# EAGLE design expresscard_micro (EAGLE 7.7.0)
A micro-controller designed to fit into an express card slot and become an integrated part of the computer
COMPANY: ADAFRUIT INDUSTRIES; DRAWN: KTOWN; REV: B
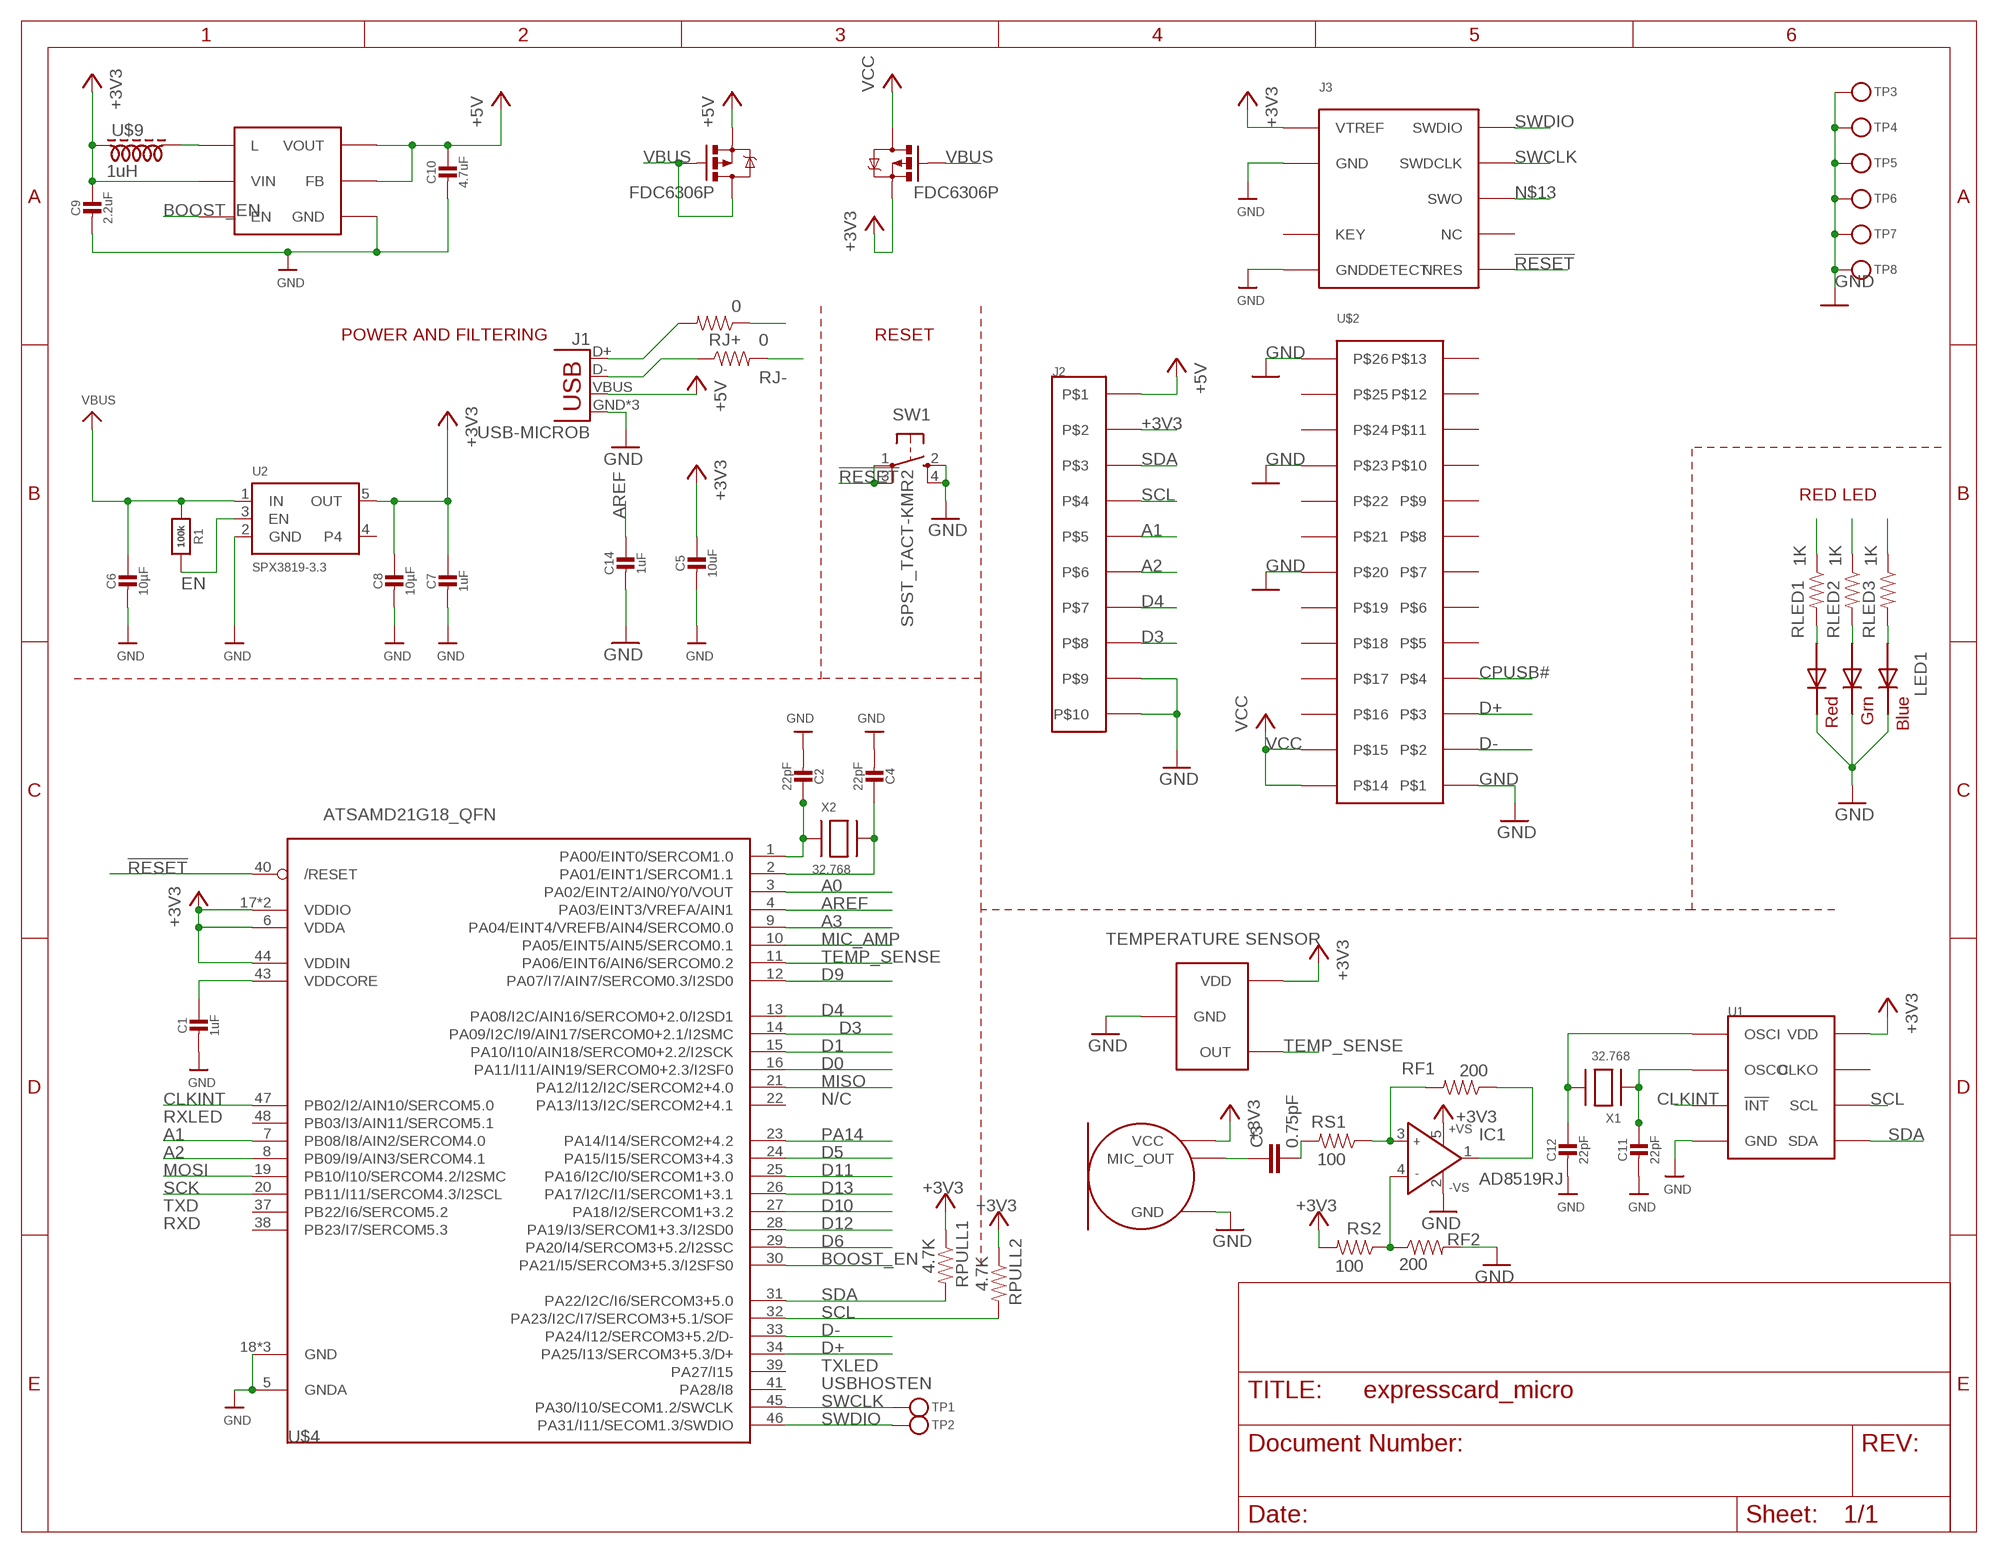
[diagram p0: schematic, sheet 1]

## Parts
C1  1uF  CAP_CERAMIC0603_NO  [0603-NO]
C2  22pF  CAP_CERAMIC0603_NO  [0603-NO]
C3  0.75pF  0.75PF-50V(-/+.25PF)(0603)  [0603-CAP]
C4  22pF  CAP_CERAMIC0603_NO  [0603-NO]
C5  10uF  CAP_CERAMIC0805-NOOUTLINE  [0805-NO]
C6  10µF  CAP_CERAMIC0805-NOOUTLINE  [0805-NO]
C7  1uF  CAP_CERAMIC0603_NO  [0603-NO]
C8  10µF  CAP_CERAMIC0805-NOOUTLINE  [0805-NO]
C9  2.2uF  CAP_CERAMIC0805-NOOUTLINE  [0805-NO]
C10  4.7uF  CAP_CERAMIC0805-NOOUTLINE  [0805-NO]
C11  22pF  CAP_CERAMIC0603_NO  [0603-NO]
C12  22pF  CAP_CERAMIC0603_NO  [0603-NO]
C14  1uF  CAP_CERAMIC0603_NO  [0603-NO]
IC1  AD8519RJ  [SOT23-5]
J1  USB-MICROB  [USB-MICROB]
J2  FCS8_10  [FCS8_10PIN]
J3  JLINK_10PIN  [FTSH-105-01-F-DH]
LED1  RGBLED5050  [RGBLED5050]
R1  100k  RESISTOR_0603_NOOUT  [0603-NO]
RF1  200  0.27OHM-1/10W-1%(0603)  [0603-RES]
RF2  200  0.27OHM-1/10W-1%(0603)  [0603-RES]
RJ+  0  0.27OHM-1/10W-1%(0603)  [0603-RES]
RJ-  0  0.27OHM-1/10W-1%(0603)  [0603-RES]
RLED1  1K  0.27OHM-1/10W-1%(0603)  [0603-RES]
RLED2  1K  0.27OHM-1/10W-1%(0603)  [0603-RES]
RLED3  1K  0.27OHM-1/10W-1%(0603)  [0603-RES]
RPULL1  4.7K  0.27OHM-1/10W-1%(0603)  [0603-RES]
RPULL2  4.7K  0.27OHM-1/10W-1%(0603)  [0603-RES]
RS1  100  0.27OHM-1/10W-1%(0603)  [0603-RES]
RS2  100  0.27OHM-1/10W-1%(0603)  [0603-RES]
SW1  SPST_TACT-KMR2  [KMR2]
TEMPSENSE  MCP9700T-E  [SOT23]
TP1  TESTPOINTROUND1.5MM  [TESTPOINT_ROUND_1.5MM]
TP2  TESTPOINTROUND1.5MM  [TESTPOINT_ROUND_1.5MM]
TP3  TESTPOINTROUND1.5MM  [TESTPOINT_ROUND_1.5MM]
TP4  TESTPOINTROUND1.5MM  [TESTPOINT_ROUND_1.5MM]
TP5  TESTPOINTROUND1.5MM  [TESTPOINT_ROUND_1.5MM]
TP6  TESTPOINTROUND1.5MM  [TESTPOINT_ROUND_1.5MM]
TP7  TESTPOINTROUND1.5MM  [TESTPOINT_ROUND_1.5MM]
TP8  TESTPOINTROUND1.5MM  [TESTPOINT_ROUND_1.5MM]
U1  PCF8563_RTC  [SO08]
U2  SPX3819-3.3  VREG_SOT23-5  [SOT23-5]
U$1  SPW2430HR5H-B  [3.1_2.5_SMD]
U$2  EXPRESSCARD  [EXPRESSCARD_PACK]
U$3  FDC6306P  [SOT-23_6]
U$4  ATSAMD21G18_QFN  ATSAMD21J  [TQFP48]
U$7  TPS61240DRVR  [WSON6]
U$9  1uH  SMD_IND  [2520(1008)]
X1  32.768  XTAL-3.2X1.5  [XTAL3215]
X2  32.768  XTAL-3.2X1.5  [XTAL3215]

## Nets
!RESET: J3.10(NRES) SW1.1(P) SW1.3(P1) U$4.40(/RESET)
+3V3: C5.1 C7.1 C8.1 C9.1 IC1.5(+VS) J2.P2 J3.1(VTREF) RPULL1.1 RPULL2.1 RS2.2 TEMPSENSE.1(VDD) U1.8(VDD) U2.5(OUT) U$1.VDD(VCC) U$3.5(S) U$4.6(VDDA) U$4.17(VDDIO) U$4.36(VDDIO) U$4.44(VDDIN) U$7.P6(VIN) U$9.1
+5V: C10.1 U$3.2(S) U$7.P2(VOUT) U$7.P3(FB)
A0: U$4.3(PA02/EINT2/AIN0/Y0/VOUT)
A1: J2.P5 U$4.7(PB08/I8/AIN2/SERCOM4.0)
A2: J2.P6 U$4.8(PB09/I9/AIN3/SERCOM4.1)
A3: U$4.9(PA04/EINT4/VREFB/AIN4/SERCOM0.0)
AREF: C14.1 U$4.4(PA03/EINT3/VREFA/AIN1)
BOOST_EN: U$4.30(PA21/I5/SERCOM3+5.3/I2SFS0) U$7.P4(EN)
CLKINT: U1.3(!INT) U$4.47(PB02/I2/AIN10/SERCOM5.0)
CPUSB#: U$2.P4
D0: RLED1.1 U$4.16(PA11/I11/AIN19/SERCOM0+2.3/I2SF0)
D1: RLED2.1 U$4.15(PA10/I10/AIN18/SERCOM0+2.2/I2SCK)
D3: J2.P8 U$4.14(PA09/I2C/I9/AIN17/SERCOM0+2.1/I2SMC)
D4: J2.P7 U$4.13(PA08/I2C/AIN16/SERCOM0+2.0/I2SD1)
D5: RLED3.1 U$4.24(PA15/I15/SERCOM3+4.3)
D6: U$4.29(PA20/I4/SERCOM3+5.2/I2SSC)
D9: U$4.12(PA07/I7/AIN7/SERCOM0.3/I2SD0)
D10: U$4.27(PA18/I2/SERCOM1+3.2)
D11: U$4.25(PA16/I2C/I0/SERCOM1+3.0)
D12: U$4.28(PA19/I3/SERCOM1+3.3/I2SD0)
D13: U$4.26(PA17/I2C/I1/SERCOM1+3.1)
D+: RJ+.1 U$2.P3 U$4.34(PA25/I13/SERCOM3+5.3/D+)
D-: RJ-.2 U$2.P2 U$4.33(PA24/I12/SERCOM3+5.2/D-)
DJ+: J1.D+ RJ+.2
DJ-: J1.D- RJ-.1
EN: R1.2 U2.3(EN)
GND: C1.2 C2.2 C4.2 C5.2 C6.2 C7.2 C8.2 C9.2 C10.2 C11.2 C12.2 C14.2 IC1.2(-VS) J1.GND J1.MT1(GND) J1.MT2(GND) J2.P9 J2.P10 J3.3(GND) J3.5(GND) J3.9(GNDDETECT) LED1.4(BLUE_C) LED1.5(RED_C) LED1.6(GREEN_C) RF2.2 SW1.2(S) SW1.4(S1) TEMPSENSE.3(GND) TP3.P$1 TP4.P$1 TP5.P$1 TP6.P$1 TP7.P$1 TP8.P$1 U1.4(GND) U2.2(GND) U$1.GND U$1.GND2(GND) U$2.P1 U$2.P20 U$2.P23 U$2.P26 U$4.5(GNDA) U$4.18(GND) U$4.35(GND) U$4.42(GND) U$7.P1(GND)
MIC_AMP: IC1.1(OUT) RF1.1 U$4.10(PA05/EINT5/AIN5/SERCOM0.1)
MISO: U$4.21(PA12/I12/I2C/SERCOM2+4.0)
MOSI: U$4.19(PB10/I10/SERCOM4.2/I2SMC)
N$1: C3.2 RS1.2
N$2: LED1.2(RED_A) RLED1.2
N$3: IC1.3(IN+) RF1.2 RS1.1
N$4: C3.1 U$1.OUTPUT(MIC_OUT)
N$5: C2.1 U$4.1(PA00/EINT0/SERCOM1.0) X2.P$1
N$6: LED1.1(GREEN_A) RLED2.2
N$7: C4.1 U$4.2(PA01/EINT1/SERCOM1.1) X2.P$2
N$8: IC1.4(IN-) RF2.1 RS2.1
N$9: LED1.3(BLUE_A) RLED3.2
N$10: U$7.P5(L) U$9.2
N$13: J3.6(SWO)
N$15: C11.1 U1.2(OSCO) X1.P$1
N$16: C12.1 U1.1(OSCI) X1.P$2
PA14: U$4.23(PA14/I14/SERCOM2+4.2)
SCK: U$4.20(PB11/I11/SERCOM4.3/I2SCL)
SCL: J2.P4 RPULL2.2 U1.6(SCL) U$4.32(PA23/I2C/I7/SERCOM3+5.1/SOF)
SDA: J2.P3 RPULL1.2 U1.5(SDA) U$4.31(PA22/I2C/I6/SERCOM3+5.0)
SWCLK: J3.4(SWDCLK) TP1.P$1 U$4.45(PA30/I10/SECOM1.2/SWCLK)
SWDIO: J3.2(SWDIO) TP2.P$1 U$4.46(PA31/I11/SECOM1.3/SWDIO)
TEMP_SENSE: TEMPSENSE.2(OUT) U$4.11(PA06/EINT6/AIN6/SERCOM0.2)
VBUS: C6.1 J1.VBUS J2.P1 R1.1 U2.1(IN) U$3.1(G) U$3.3(G) U$3.4(D) ; supply symbol labelled +5V
VCC: U$2.P14 U$2.P15 U$3.6(D)
VDDCORE: C1.1 U$4.43(VDDCORE)
Unconnected: J3.7(KEY) J3.8(NC) U1.7(CLKO) U2.4 U$2.P5 U$2.P6 U$2.P7 U$2.P8 U$2.P9 U$2.P10 U$2.P11 U$2.P12 U$2.P13 U$2.P16 U$2.P17 U$2.P18 U$2.P19 U$2.P21 U$2.P22 U$2.P24 U$2.P25 U$4.22(PA13/I13/I2C/SERCOM2+4.1) U$4.37(PB22/I6/SERCOM5.2) U$4.38(PB23/I7/SERCOM5.3) U$4.39(PA27/I15) U$4.41(PA28/I8) U$4.48(PB03/I3/AIN11/SERCOM5.1)

## Notes on the sheet
- POWER AND FILTERING | RESET
- RED LED
- TEMPERATURE SENSOR
- N/C
- RXLED
- TXD
- RXD
- TXLED
- USBHOSTEN

## Library data of the parts
C1 C2 C4-C12 C14 = microbuilder:CAP_CERAMIC: Ceramic Capacitors For new designs, use the packages preceded by an '_' character since they are more reliable: The following footprints should be used on most boards: _0402 - Standard footprint for regular board layouts _0603 - Standard footprint for regular board layouts _0805 - Standard footprint for regular board layouts _1206 - Standard footprint for regular board layouts For extremely tight-pitch boards where space is at a premium, the following 'micro-pitch' footprints can be used (smaller pads, no silkscreen outline, etc.): _0402MP - Micro-pitch footprint for very dense/compact boards _0603MP - Micro-pitch footprint for very dense/compact boards _0805MP - Micro-pitch footprint for very dense/compact boards _1206MP - Micro-pitch footprint for very dense/compact boards
C3 = SparkFun-Capacitors:0.75PF-50V(-/+.25PF)(0603): CAP-07878; PROD_ID: CAP-07878
IC1 = analog-devices:AD8519: 8 MHz Rail-to-Rail Operational Amplifiers Source: http://www.analog.com/static/imported-files/data_sheets/AD8519_8529.pdf; MF: ALTERA CORPORATION; MPN: AD8519ARTZ-REEL7; OC_FARNELL: 1464960; OC_NEWARK: 59K6794
J1 = SparkFun-Connectors:USB: USB Connectors USB-B-PTH is fully proven SKU : PRT-00139/CONN-08278 USB-miniB is fully proven SKU : PRT-00587 USB-A-PCB is untested. USB-A-H is throughly reviewed, but untested. Spark Fun Electronics SKU : PRT-00437 USB-B-SMT is throughly reviewed, but untested. Needs silkscreen touching up. USB-A-S has not been used/tested USB-MB-H has not been used/tested USB-MICROB has been used. CONN-09505; PROD_ID: CONN-09505
J2 = expresscard:FCS8_10
J3 = expresscard:JLINK_10PIN
LED1 = adafruit:RGBLED: For 5050 RGB LEDs, the order of the LEDs may vary from one manufacturer to another!
R1 = microbuilder:RESISTOR: Resistors For new designs, use the packages preceded by an '_' character since they are more reliable: The following footprints should be used on most boards: _0402 - Standard footprint for regular board layouts _0603 - Standard footprint for regular board layouts _0805 - Standard footprint for regular board layouts _1206 - Standard footprint for regular board layouts For extremely tight-pitch boards where space is at a premium, the following 'micro-pitch' footprints can be used (smaller pads, no silkscreen outline, etc.): _0402MP - Micro-pitch footprint for very dense/compact boards _0603MP - Micro-pitch footprint for very dense/compact boards _0805MP - Micro-pitch footprint for very dense/compact boards _1206MP - Micro-pitch footprint for very dense/compact boards
RF1 RF2 RJ+ RJ- RLED1-RLED3 RPULL1 RPULL2 RS1 RS2 = SparkFun-Resistors:0.27OHM-1/10W-1%(0603): RES-08787; PROD_ID: RES-08787
SW1 = adafruit:SPST_TACT: SMT 6mm switch, EVQQ2 series http://www.ladyada.net/library/eagle
TEMPSENSE = adafruit:MCP9700T-E
TP1-TP8 = microbuilder:TESTPOINT: Test Point Various test points for characterisation and PCB testing TESTPOINT_SMT - Compact Surface Mount Test Point [Digikey: 5016KTR-ND]
U1 = expresscard:PCF8563_RTC
U2 = microbuilder:VREG_SOT23-5: SOT23-5 Fixed Voltage Regulators Part Current Out V Out V In V Dropout θJA (°C/W) TJ (°C) Digikey Part No. ADP121 150mA 3.3V 3.4-5.5V 0.09V @ 150mA -- -- ADP121-AUJZ33R7CT-ND ADP121 150mA 3.0V 3.1-5.5V 0.09V @ 150mA -- -- ADP121-AUJZ30R7CT-ND ADP122 300mA 3.3V 3.4-5.5V 0.085V @ 300mA -- -- ADP122AUJZ-3.3-R7CT-ND ADP1712 300mA 3.3V 3.5-5.5V 0.17V @ 300mA -- -- ADP1712AUJZ-3.3-R7TR-ND AP7311 (Low Cost) 150mA 3.3V 3.5-6V 0.15V @ 150mA -- -- AP7311-33WG-7DICT-ND LD39015M18R 150mA 1.8V 1.9V-5.5V 0.08V @ 100mA -- -- 497-6977-1-ND LP2985A-33DBVR 150mA 3.3V 3.3-16V 0.28V @ 150mA 206 150 296-18479-1-ND MCP1824T-3302E/OT 300mA 3.3V 3.5V-6V 0.2V @ 300mA -- -- MCP1824T-3302E/OTCT-ND MIC5205-2.5YM5 TR 150mA 2.5V 2.7-16V 0.165V @ 150mA -- -- 576-1257-2-ND MIC5205-3.0YM5 TR 150mA 3.0V 3.2V-16V 0.165V @ 150mA -- -- 576-1258-2-ND MIC5205-3.3YM5 TR 150mA 3.3V 3.5V-16V 0.165V @ 150mA -- -- 576-1259-2-ND TPS780330220 150mA 3.3V+2.2V 3.6-5.5V 250mV Max -- -- 296-23332-1-ND TDA3663/N1,135 100mA 3.3V 3.5-45V 0.18V @ 50mA -- -- 568-5343-1-ND Max operating temp can be calculated using θJA, TJ (max junction temperature), and power in watts. Set the "Maximum Ambient Temperature" until it reaches TJ ("Max Junction Temperature"), which is the absolute limit for safe use of the regulator: Heat Sink Temperature Calculator <http://www.daycounter.com/Calculators/Heat-Sink-Temperature-Calculator.phtml> For example, With 12V source into a 3.3V LP2985 and a 30mA load, we are dissipating (12V-3.3V) * 0.03A = 0.261W. With a θJA of 206 °C/W, a TJ of 150°C, and 261mW we can safely use the chip without a heat sink up to 75°C (=147.1°C Junction Temperature).
U$1 = expresscard:SPW2430HR5H-B
U$2 = expresscard:EXPRESSCARD
U$3 = expresscard:FDC6306P
U$4 = con-customer:ATSAMD21J
U$7 = expresscard:TPS61240DRVR
U$9 = expresscard:SMD_IND
X1 X2 = adafruit2:XTAL: Low cost SMT crystals, no capacitors included http://www.ladyada.net/library/eagle

## Board
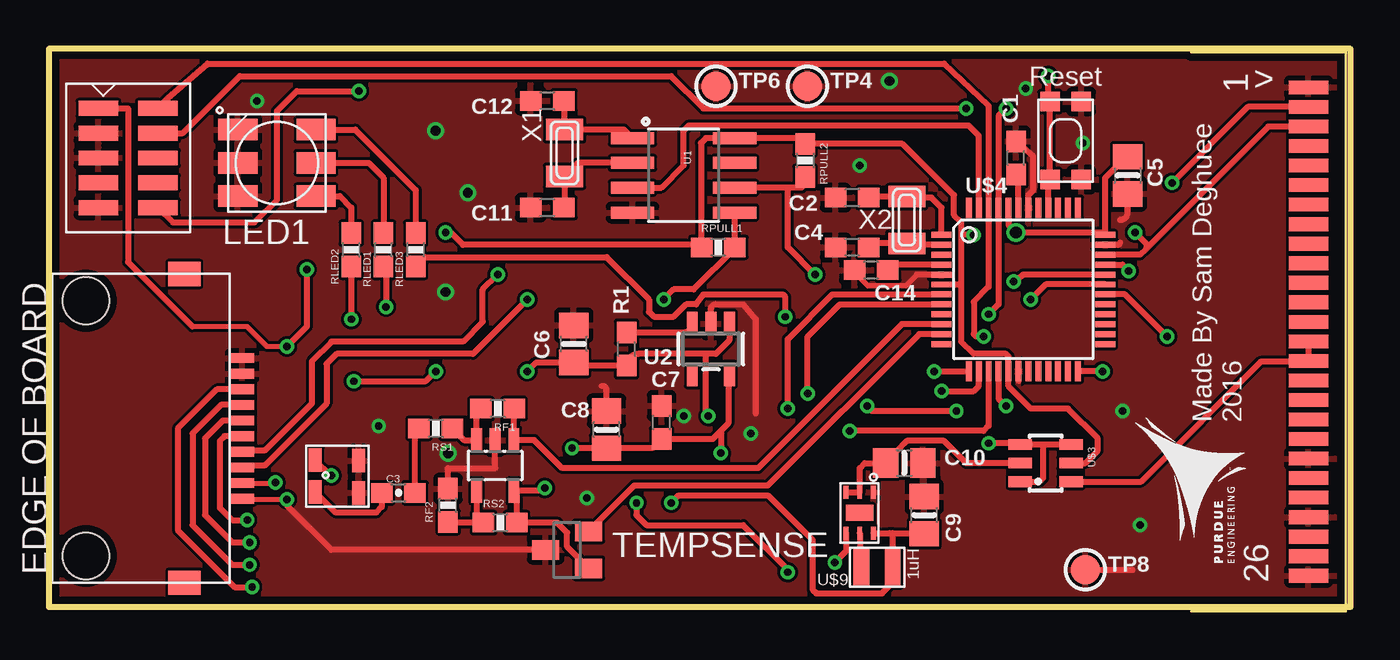
[diagram p1: board, top side]
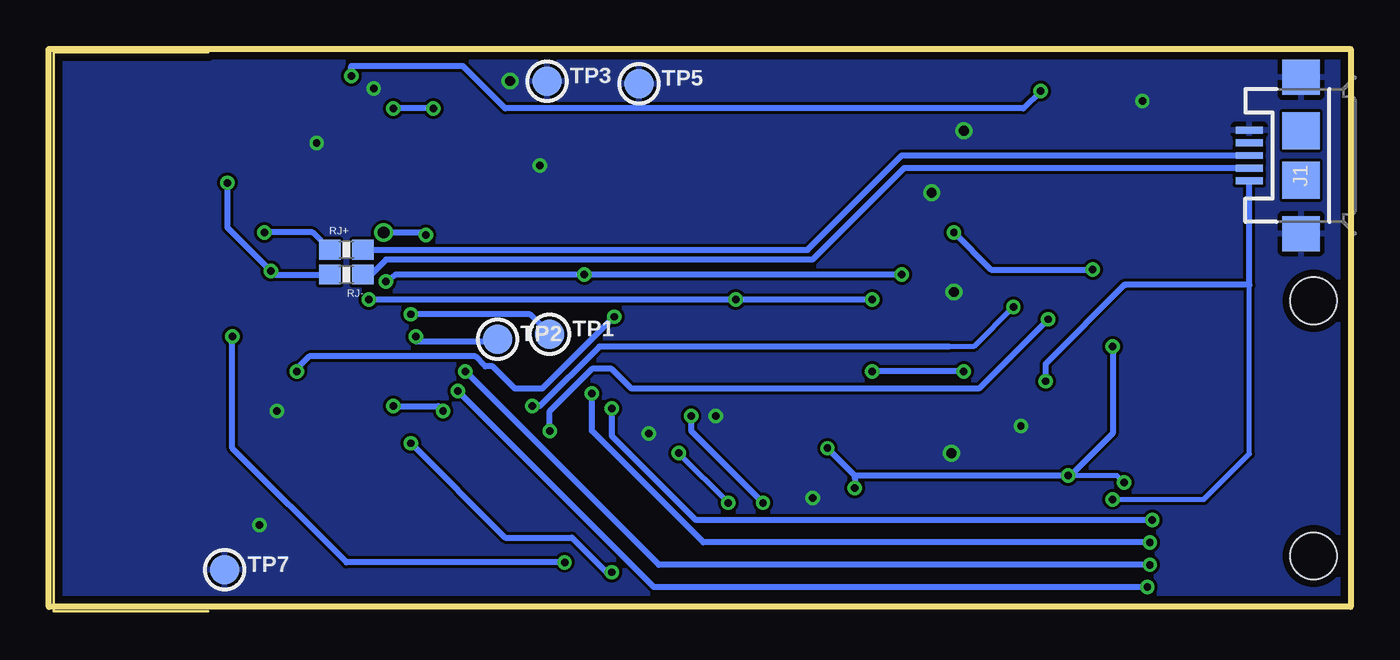
[diagram p2: board, bottom side, seen from below]

Size 66.67 x 28.57 mm. Coordinates in mm from the lower left corner, seen from the top.
Outline: 0,0 66.67,0 66.67,28.57 0,28.57 0,0
Copper layers (1*16): Top 0.0356mm / dielectric 1.5011mm / Bottom 0.0356mm
Design rules "LaenPCBOrder": minimum track width 6mil, minimum drill 13mil, track to track 6mil, track to pad 6mil, pad to pad 6mil, via to via 6mil, smd to smd 6mil, copper to edge 15mil, drill to drill 6mil, minimum pad ring 7mil, minimum via ring 7mil, stop-mask expansion 3mil, vias tented up to drill 0mil, thermal gap 10mil

### Footprints (pad centres in the part's own frame; a part is rotated, then mirrored left to right if it is on the bottom)
0603-NO = smd 1.1 x 1: 1 -0.85,0; 2 0.85,0
0603-CAP = smd 1.1 x 1: 1 -0.85,0; 2 0.85,0
0805-NO = smd 1.3 x 1.5: 1 -0.95,0; 2 0.95,0
SOT23-5 = smd 0.55 x 1.2: 1 -0.95,-1.3; 2 0,-1.3; 3 0.95,-1.3; 4 0.95,1.3; 5 -0.95,1.3
USB-MICROB = smd 0.35 x 1.4: D+ 0,2.65; D- -0.65,2.65; GND 1.3,2.65; ID 0.65,2.65; VBUS -1.3,2.65 | smd 1.8 x 1.9: MT1 -4,0; MT2 4,0 | smd 1.9 x 1.9: P$1 -1.27,0; P$2 1.27,0
FCS8_10PIN = smd 1.25 x 1.65: 11 7.905,-2.32; 12 -7.905,-2.32 | smd 0.5 x 1.25: P1 3.6,0.625; P2 2.8,0.625; P3 2,0.625; P4 1.2,0.625; P5 0.4,0.625; P6 -0.4,0.625; P7 -1.2,0.625; P8 -2,0.625; P9 -2.8,0.625; P10 -3.6,0.625 | hole 2.4: 6.53,-7.37; -6.53,-7.37
FTSH-105-01-F-DH = smd 0.76 x 2.03: 1 2.54,1.525; 2 2.54,-1.525; 3 1.27,1.525; 4 1.27,-1.525; 5 0,1.525; 6 0,-1.525; 7 -1.27,1.525; 8 -1.27,-1.525; 9 -2.54,1.525; 10 -2.54,-1.525
RGBLED5050 = smd 2 x 1.1: 1 -2,1.7; 2 -2,0; 3 -2,-1.7; 4 2,-1.7; 5 2,0; 6 2,1.7
0603-RES = smd 1.1 x 1: 1 -0.85,0; 2 0.85,0
KMR2 = smd 1 x 1: 1 2,0.8; 2 2,-0.8; 3 -2,0.8; 4 -2,-0.8
SOT23 = smd 1 x 1.4: 1 -0.95,-1.1; 2 0.95,-1.1; 3 0,1.1
TESTPOINT_ROUND_1.5MM = smd 1.5 x 1.5: P$1 0,0
SO08 = smd 0.61 x 2.21: 1 -1.905,-2.616; 2 -0.635,-2.616; 3 0.635,-2.616; 4 1.905,-2.616; 5 1.905,2.616; 6 0.635,2.616; 7 -0.635,2.616; 8 -1.905,2.616
3.1_2.5_SMD = smd 1.2 x 0.66: GND 0,0; GND2 1.65,0; OUTPUT 0.04,2.23; VDD 1.69,2.23
EXPRESSCARD_PACK = smd 0.7 x 2: P1 -12.5,0; P2 -11.5,0; P3 -10.5,0; P4 -9.5,0; P5 -8.5,0; P6 -7.5,0; P7 -6.5,0; P8 -5.5,0; P9 -4.5,0; P10 -3.5,0; P11 -2.5,0; P12 -1.5,0; P13 -0.5,0; P14 0.5,0; P15 1.5,0; P16 2.5,0; P17 3.5,0; P18 4.5,0; P19 5.5,0; P20 6.5,0; P21 7.5,0; P22 8.5,0; P23 9.5,0; P24 10.5,0; P25 11.5,0; P26 12.5,0
SOT-23_6 = smd 0.55 x 1.2: 1 0.95,-1.3; 2 0,-1.3; 3 -0.95,-1.3; 4 -0.95,1.3; 5 0,1.3; 6 0.95,1.3
TQFP48 = smd 1.016 x 0.305: 1 -4.191,2.794; 2 -4.191,2.286; 3 -4.191,1.778; 4 -4.191,1.27; 5 -4.191,0.762; 6 -4.191,0.254; 7 -4.191,-0.254; 8 -4.191,-0.762; 9 -4.191,-1.27; 10 -4.191,-1.778; 11 -4.191,-2.286; 12 -4.191,-2.794; 25 4.191,-2.794; 26 4.191,-2.286; 27 4.191,-1.778; 28 4.191,-1.27; 29 4.191,-0.762; 30 4.191,-0.254; 31 4.191,0.254; 32 4.191,0.762; 33 4.191,1.27; 34 4.191,1.778; 35 4.191,2.286; 36 4.191,2.794 | smd 0.305 x 1.016: 13 -2.794,-4.191; 14 -2.286,-4.191; 15 -1.778,-4.191; 16 -1.27,-4.191; 17 -0.762,-4.191; 18 -0.254,-4.191; 19 0.254,-4.191; 20 0.762,-4.191; 21 1.27,-4.191; 22 1.778,-4.191; 23 2.286,-4.191; 24 2.794,-4.191; 37 2.794,4.191; 38 2.286,4.191; 39 1.778,4.191; 40 1.27,4.191; 41 0.762,4.191; 42 0.254,4.191; 43 -0.254,4.191; 44 -0.762,4.191; 45 -1.27,4.191; 46 -1.778,4.191; 47 -2.286,4.191; 48 -2.794,4.191
WSON6 = smd 1.4 x 0.8: 1 0,0 | smd 0.25 x 0.65: P1 0.7,1.05; P2 0,1.05; P3 -0.7,1.05; P4 -0.7,-1.05; P5 0,-1.05; P6 0.7,-1.05
2520(1008) = smd 0.8 x 2: 1 0.8,0; 2 -0.8,0
XTAL3215 = smd 1.1 x 1.9: P$1 1.2,0; P$2 -1.2,0

### Placement (x,y rotation side)
C1  49.53,22.99 90 top
C2  41.15,20.95 180 top
C3  17.91,5.84 0 top
C4  41.15,18.41 180 top
C5  55.25,22.1 270 top
C6  26.88,13.47 90 top
C7  31.39,9.45 90 top
C8  28.56,9.08 90 top
C9  44.83,4.7 90 top
C10  43.82,7.37 0 top
C11  25.53,20.45 180 top
C12  25.53,25.91 180 top
C14  42.11,17.25 180 top
IC1  22.86,7.24 180 top
J1  2.54,23.11 90 bottom
J2  9.27,9.14 270 top
J3  4.06,22.99 90 top
LED1  11.68,22.73 180 top
R1  29.59,13.21 90 top
RF1  22.99,10.16 180 top
RF2  20.45,5.21 90 top
RJ+  51.44,18.29 0 bottom
RJ-  51.44,17.02 180 bottom
RLED1  17.14,18.29 90 top
RLED2  15.49,18.29 90 top
RLED3  18.8,18.29 90 top
RPULL1  34.29,18.41 0 top
RPULL2  38.73,22.86 270 top
RS1  19.81,9.14 180 top
RS2  23.11,4.32 0 top
SW1  52.07,23.88 90 top
TEMPSENSE  26.54,2.92 90 top
TP1  41.02,13.97 0 bottom
TP2  43.69,13.72 0 bottom
TP3  41.15,26.92 0 bottom
TP4  38.86,26.67 0 top
TP5  36.45,26.8 0 bottom
TP6  34.16,26.67 0 top
TP7  57.66,1.91 0 bottom
TP8  53.09,1.91 0 top
U1  32.51,22.1 270 top
U2  33.91,13.21 180 top
U$1  15.88,5.84 90 top
U$2  64.52,14.1 270 top
U$3  51.05,7.37 270 top
U$4  49.91,16.26 0 top
U$7  41.53,4.83 0 top
U$9  42.42,2.03 0 top
X1  26.42,23.24 270 top
X2  43.94,19.81 90 top

### Tracks (layer width: path | path; a pad name or v marks a point on that pad's centre or on a via)
!RESET  (via drill 0.38)
  Top 0.305: U$4.40 51.18,21.88 SW1.3 SW1.1 51.18,25.96 v51.18,27.18 | J3.10 6.35,19.68 10.54,19.68 11.68,20.83 11.68,25.4 12.7,26.42 v15.88,26.42
  Bottom 0.305: v15.88,26.42 16.76,25.53 43.31,25.53 45.47,27.69 51.18,27.69 v51.18,27.18
+3V3  (via drill 0.38, 0.6)
  Top 0.254: J2.P2 11.58,6.34 v11.61,6.38 | v12.19,13.34 11.18,13.34 10.16,14.35 7.37,14.35
  Top 0.305: U$3.5 53.09,7.37 53.72,8 53.72,8.64 52.2,10.16 50.29,10.16 49.15,11.3 U$4.17 49.15,12.83 49.02,12.95 47.37,12.95 46.74,13.59 46.74,16.38 | U$7.P6 43.05,3.78 | 43.05,3.78 43.22,3.78 U$9.1 43.22,1.18 43.15,1.18 42.67,0.7 39.31,0.7 39.12,0.89 39.12,3.43 36.83,5.71 32.26,5.71 v31.88,5.33 | C9.1 43.05,3.75 43.05,3.78 | C5.1 55.18,23.05 54.1,21.97 U$4.36 53.98,19.18 v49.53,19.18 49.15,19.56 U$4.44 | U2.5 34.8,11.85 34.8,9.4 34.42,9.02 | 34.42,9.02 34,8.6 C7.1 30.91,8.13 C8.1 v26.8,8.13 | v25.4,6.1 25.24,5.94 IC1.5 23.96,5.79 RS2.2 26.04,4.32 26.54,3.81 26.54,3.07 TEMPSENSE.1 | 34.42,9.02 v34.42,7.87 | U$1.VDD 13.55,7.53 v14.48,6.73 | J3.1 4.06,25.53 4.06,17.65 7.37,14.35 | 46.74,16.38 46.74,19.05 | 46.74,19.05 46.74,19.68 46.36,20.07 46.36,21.08 43.73,23.71 RPULL2.1 38.82,24 U1.8 33.66,24 33.4,23.75 33.4,18.45 RPULL1.1 33.31,18.54 21.21,18.54 20.57,19.18 v20.32,19.18 | U$4.6 46.61,16.51 46.74,16.38 | v47.37,19.05 46.74,19.05 | v13.21,17.27 13.21,14.35 v12.19,13.34
  Bottom 0.254: v34.42,7.87 v31.88,5.33 | v11.61,6.38 11.96,6.73 v14.48,6.73
  Bottom 0.305: v26.8,8.13 25.4,6.73 25.4,6.6 | 25.4,6.6 v25.4,6.1 | 25.4,6.6 25.27,6.73 v14.48,6.73 14.35,6.73 12.19,8.89 v12.19,13.34 | v49.53,19.18 47.5,19.18 v47.37,19.05 | v20.32,19.18 18.41,17.27 v13.21,17.27
+5V
  Top 0.305: U$7.P3 U$7.P2 41.53,7.11 41.78,7.37 C10.1 43.82,8.38 43.94,8.51 45.85,8.51 46.99,7.37 U$3.2
A1  (via drill 0.38)
  Top 0.305: J2.P5 9,8.74 8.76,8.51 8.76,5.08 9.4,4.45 v10.16,4.45 | v37.85,10.16 37.85,13.72 40.13,16 U$4.7
  Bottom 0.305: v10.16,4.45 33.53,4.45 37.85,8.76 v37.85,10.16
A2  (via drill 0.38)
  Top 0.305: J2.P6 8.91,9.54 8,8.64 8,4.7 9.4,3.3 v10.29,3.3 | v38.86,10.92 38.86,13.84 40.51,15.49 U$4.8
  Bottom 0.305: v10.29,3.3 33.15,3.3 38.86,9.02 v38.86,10.92
AREF
  Top 0.305: U$4.4 43.24,17.53 C14.1
BOOST_EN  (via drill 0.38)
  Top 0.305: U$7.P4 40.83,2.86 v40.26,2.29 | v57.28,13.84 55.12,16 U$4.30
  Bottom 0.305: v40.26,2.29 51.44,2.29 57.28,8.13 v57.28,13.84
CLKINT
  Top 0.305: U$4.47 47.62,24.13 47.12,24.64 32.77,24.64 32.51,24.38 32.51,22.61 31.37,21.46 U1.3
D0  (via drill 0.38)
  Top 0.305: RLED1.1 17.27,17.31 v17.27,15.37 | 42.04,10.16 v41.91,10.29 42.16,10.03 v46.48,10.03 | U$4.16 48.64,10.67 v49.02,10.29
  Bottom 0.254: v17.27,15.37 19.3,13.34 20.57,13.34
  Bottom 0.305: 20.57,13.34 38.48,13.34 41.53,10.29 v41.91,10.29 | v49.02,10.29 46.74,10.29 v46.48,10.03
D1  (via drill 0.38)
  Top 0.305: RLED2.1 v15.49,14.73 | U$4.15 48.13,9.27 47.88,9.02 v41.02,9.02
  Bottom 0.305: v15.49,14.73 19.05,11.18 36.83,11.18 37.85,12.19 38.86,12.19 41.02,10.03 v41.02,9.02
D3  (via drill 0.38)
  Top 0.305: J2.P8 8.6,11.14 6.6,9.14 6.6,3.94 9.52,1.02 v10.41,1.02 | v45.72,11.05 47.37,11.05 47.62,11.3 U$4.14
  Bottom 0.305: v10.41,1.02 35.69,1.02 v45.72,11.05
D4  (via drill 0.38)
  Top 0.305: J2.P7 8.82,10.34 7.37,8.89 7.37,4.19 9.4,2.16 v10.29,2.16 | v45.34,12.06 U$4.13
  Bottom 0.305: v10.29,2.16 35.43,2.16 v45.34,12.06
D5  (via drill 0.38)
  Top 0.305: RLED3.1 19.27,17.91 28.57,17.91 30.73,15.75 30.73,15.11 30.99,14.86 32,14.86 32.64,15.49 33.15,15.49 33.53,16 37.59,16 37.72,15.88 v37.72,14.86 | v53.98,12.06 U$4.24
  Bottom 0.305: v53.98,12.06 53.98,12.19 53.34,12.83 44.83,12.83 44.32,12.32 43.94,12.32 42.8,11.18 41.4,11.18 v37.72,14.86
D+  (via drill 0.38)
  Top 0.305: U$2.P3 62.44,24.6 56.2,18.35 | 56.2,18.35 55.88,18.03 U$4.34 | v55.63,19.18 56.2,18.61 56.2,18.35
  Bottom 0.305: RJ+.1 53.17,19.18 v55.63,19.18
D-  (via drill 0.38)
  Top 0.305: U$2.P2 61.41,25.6 v57.53,21.72 | U$4.33 54.99,17.53 v55.31,17.21
  Bottom 0.305: v57.53,21.72 57.53,19.43 55.63,17.53 v55.31,17.21 55.12,17.02 RJ-.2
DJ+
  Bottom 0.305: RJ+.2 27.81,18.29 22.99,23.11 J1.D+
DJ-
  Bottom 0.305: J1.D- 22.88,22.46 27.56,17.78 49.4,17.78 50.16,17.02 RJ-.1
EN
  Top 0.305: R1.2 32.51,14.06 arc90 U2.3
GND  (via drill 0.38, 0.5)
  Top 0.254: 44.45,17.02 43.89,16.44 41.94,16.44 41.26,17.14
  Top 0.305: RF2.2 20.45,7.11 22.86,7.11 IC1.2 | U$4.18 49.66,11.56 | U$4.5 44.45,17.02 | U$4.42 50.16,21.08 50.42,21.34 50.42,23.07 C1.2 | C5.2 55.25,20.19 arc-90 54.86,19.81 | 54.86,18.67 arc-90 54.74,18.54 U$4.35 | 33.91,14.86 U2.2 33.91,15.24 arc-90 34.16,15.49 35.56,15.49 36.2,14.73 36.2,9.91 | TEMPSENSE.3 14.48,2.92 12.19,5.21 | C8.2 28.56,11.19 28.45,11.3 28.32,11.3 | TP8.P$1 55.5,1.91 | 41.26,17.14 C14.2
  other vias: 16.89,9.27 19.81,24.38 21.46,21.21 41.53,22.61 43.05,26.92 27.56,5.59 54.99,10.03 52.96,23.75 50.04,26.54 35.94,8.89 32.51,9.78 20.45,7.87 20.32,16.13 10.67,25.91 55.88,4.19
  pour Bottom: 0,-2.03 67.44,-2.03 67.44,29.46 0,29.46
  pour Top: 0.13,-2.16 67.94,-2.16 67.94,30.23 0.13,30.23
MIC_AMP
  Top 0.305: U$4.10 43.69,14.48 36.32,7.11 26.29,7.11 24.86,8.54 IC1.1 23.84,8.57 RF1.1
N$1
  Top 0.305: C3.2 18.76,8.94 RS1.2
N$2
  Top 0.305: LED1.2 16.38,22.73 17.14,21.97 RLED1.2
N$3
  Top 0.305: 21.88,8.51 IC1.3 | IC1.3 21.91,9.93 RF1.2 | RS1.1 21.27,8.54 IC1.3
N$4
  Top 0.305: 13.55,5.88 U$1.OUTPUT 14.7,4.83 16.76,4.83 17.06,5.12 C3.1
N$5
  Top 0.305: U$4.1 45.72,20.45 45.21,20.95 44,20.95 X2.P$1 42.05,21.01 C2.1
N$6
  Top 0.305: LED1.1 14.91,21.03 15.49,20.45 RLED2.2
N$7
  Top 0.305: U$4.2 44.23,18.55 X2.P$2 42.2,18.61 C4.1
N$8
  Top 0.305: IC1.4 21.91,4.67 RS2.1 20.49,4.32 RF2.1
N$9
  Top 0.305: LED1.3 15.7,24.43 18.8,21.34 RLED3.2
N$10
  Top 0.305: U$7.P5 41.53,1.65 U$9.2
N$15
  Top 0.305: U1.2 27.11,22.73 X1.P$1 26.42,20.49 C11.1
N$16
  Top 0.305: U1.1 29.46,24.44 X1.P$2 26.42,25.87 C12.1
SCL  (via drill 0.38)
  Top 0.305: U$4.32 49.91,17.02 v49.42,16.65 | J2.P4 9.95,8 11.05,8 13.46,10.41 13.46,12.57 14.48,13.59 21.21,13.59 22.22,14.61 22.22,16.26 v22.99,17.02 | RPULL2.2 38.57,21.46 37.85,21.46 | 37.85,21.46 U1.6 | v39.24,17.02 37.85,18.41 37.85,21.46
  Bottom 0.305: v22.99,17.02 v39.24,17.02 48.9,17.02 v49.42,16.65
SDA  (via drill 0.38)
  Top 0.305: U$4.31 51.05,16.51 v50.29,15.75 | J2.P3 9.99,7.24 11.05,7.24 14.22,10.41 14.22,12.45 14.73,12.95 21.72,12.95 v24.51,15.75 | U1.5 35.14,20.18 RPULL1.2 35.14,18.38 33.02,16.26 32,16.26 v31.5,15.75
  Bottom 0.305: v50.29,15.75 v31.5,15.75 v24.51,15.75
SWCLK  (via drill 0.38)
  Top 0.305: v48.13,14.99 48.64,15.49 U$4.45 48.64,25.15 v49.02,25.53 | J3.4 6.86,24.26 9.78,27.18 31.88,27.18 33.53,25.53 v46.99,25.53
  Bottom 0.305: TP1.P$1 42.04,14.99 v48.13,14.99 | v46.99,25.53 v49.02,25.53
SWDIO  (via drill 0.38)
  Top 0.305: J3.2 6.1,26.03 6.1,26.04 8.13,27.81 45.85,27.81 48.13,25.65 U$4.46 48.13,16.38 47.37,15.62 47.37,13.97 47.5,13.84 v47.88,13.84
  Bottom 0.305: 43.56,13.84 TP2.P$1 43.82,13.59 47.88,13.59 v47.88,13.84
TEMP_SENSE
  Top 0.305: U$4.11 44.58,13.97 36.83,6.22 29.99,6.22 TEMPSENSE.2
VBUS  (via drill 0.38)
  Top 0.254: J2.P1 9.93,5.51 v12.19,5.51
  Top 0.305: U$3.4 50.93,8.32 | 50.93,8.32 U$3.3 49.69,8.38 v48.13,8.38 | U$3.1 50.74,6.42 50.93,6.6 50.93,8.32 | U2.1 34.86,13.65 34.16,12.95 33.66,12.95 | 33.66,12.95 30.19,12.95 arc90 R1.1 27.04,12.36 arc-90 C6.1 | 33.66,12.95 33.66,9.91 v33.78,9.78 | v30.1,5.33 30.1,4.7 30.61,4.19 35.56,4.19 37.85,1.91 v37.85,1.78 | 26.69,12.32 C6.1 | v15.62,11.56 19.3,11.56 v19.81,12.06 | v24.51,12.06 24.96,12.52 C6.1
  Bottom 0.254: v12.19,5.51 7.52,5.51 5.19,7.84 5.19,16.49
  Bottom 0.305: J1.VBUS 5.19,16.49 11.54,16.49 11.56,16.51 15.62,12.45 v15.62,11.56 | v48.13,8.38 43.31,3.56 39.88,3.56 38.1,1.78 v37.85,1.78 | v33.78,9.78 33.78,9.02 v30.1,5.33 | v19.81,12.06 v24.51,12.06
VCC
  Top 0.305: U$2.P14 U$2.P15 64.49,12.57 62.1,12.57 55.95,6.42 U$3.6
VDDCORE
  Top 0.305: U$4.43 49.66,22.14 C1.1

### Text on the board
tPlace: Reset | Made By Sam Deghuee / 2016
_tNames: TP6 | TP4 | C12 | X1 | C1 | U1 | C5 | C11 | C2 | U$4 | LED1 | RPULL1 | C4 | X2 | RPULL2 | RLED3 | C14 | RLED1 | R1 | RLED2 | C6 | U2 | C7 | RF1 | C3 | RS1 | U$3 | C8 | C10 | RS2 | RF2 | TEMPSENSE | U$9 | C9 | TP8
_bNames: TP5 | TP3 | J1 | RJ+ | RJ- | TP1 | TP2 | TP7
201bmp: C:/Users/sdegh/Desktop/v7nqiV3q.bmp